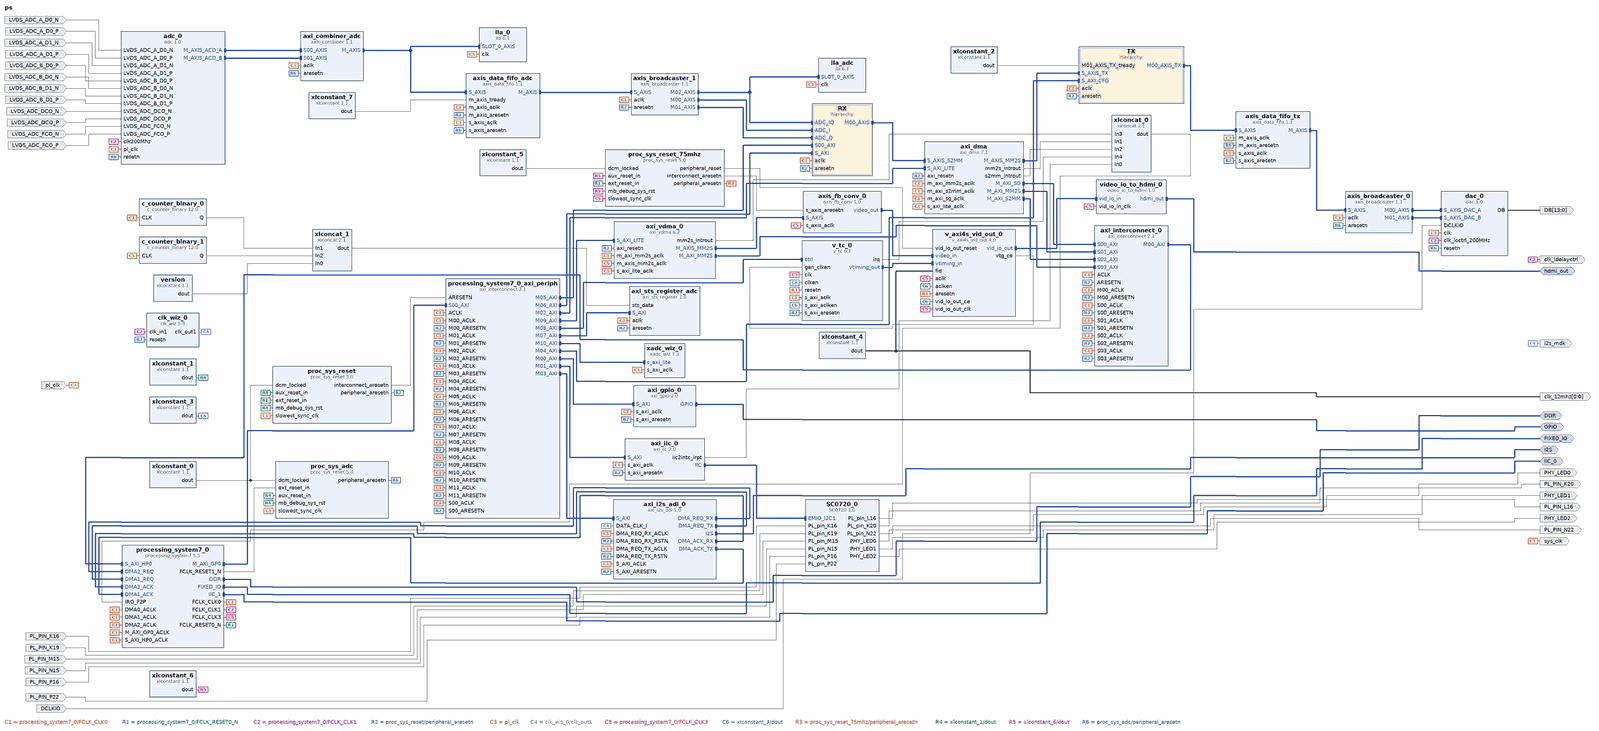
[diagram p0: block diagram of the top level, whole]
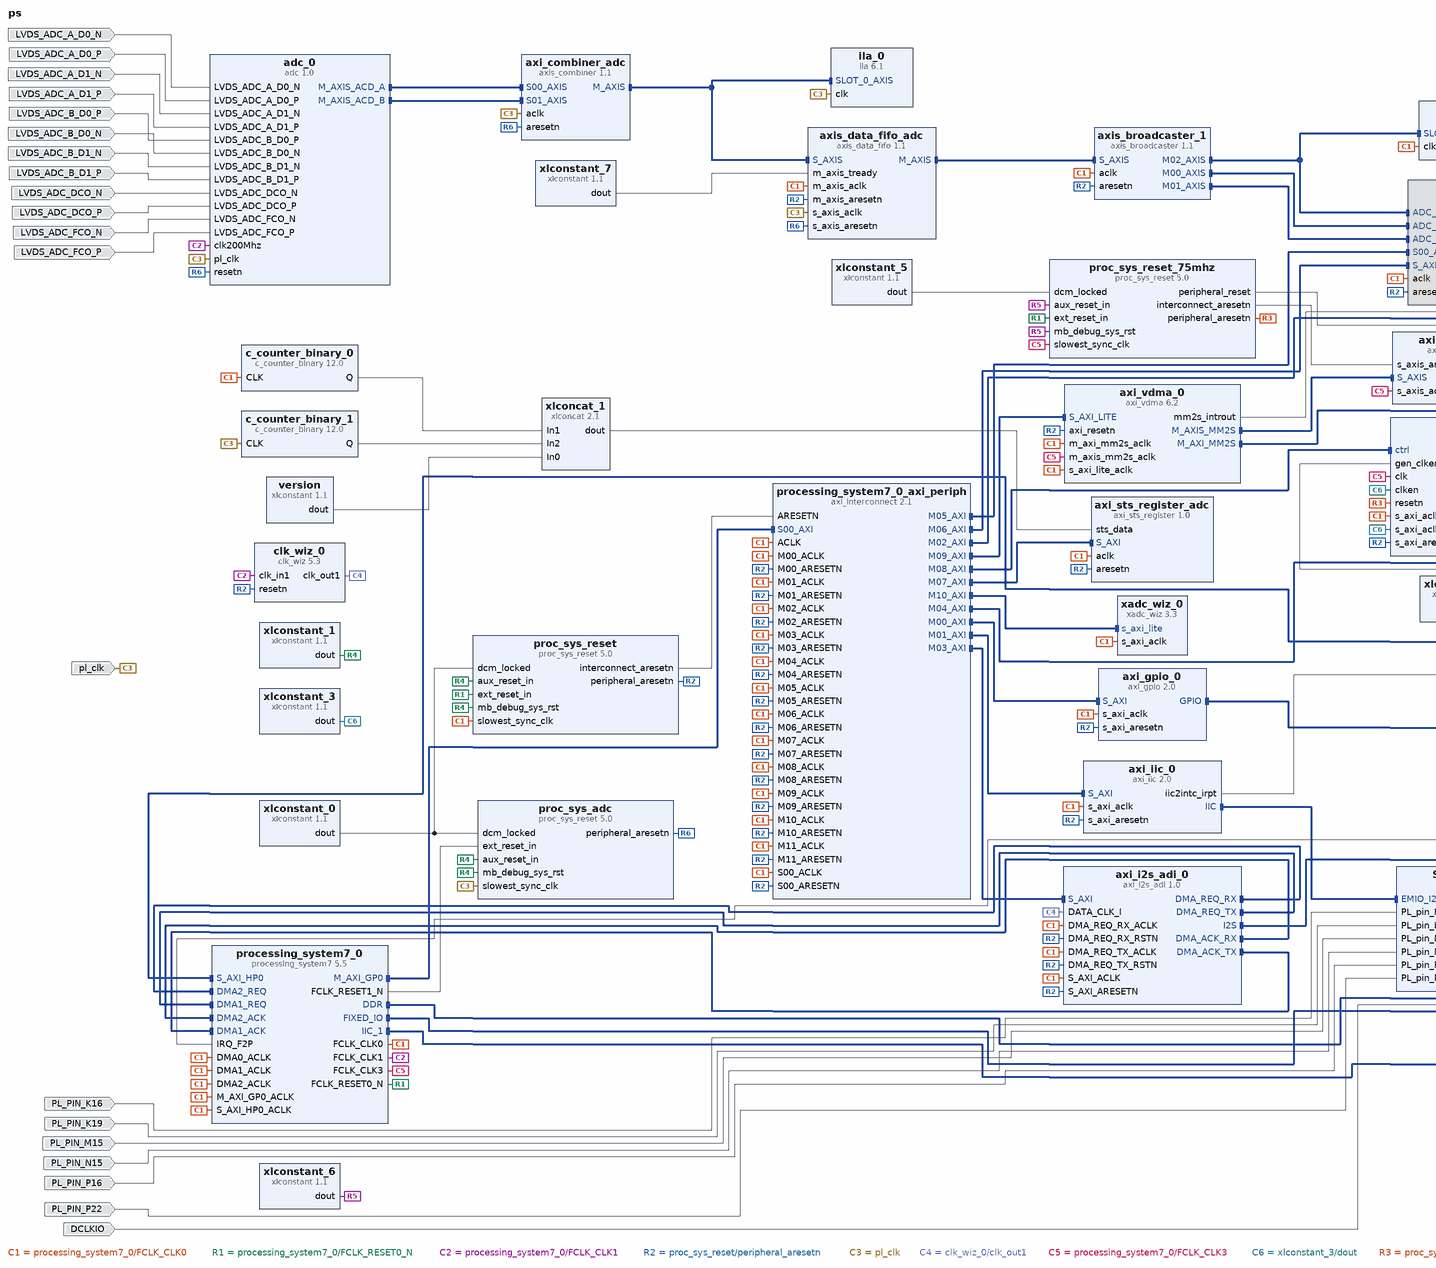
[diagram p1: block diagram of the top level, left part]
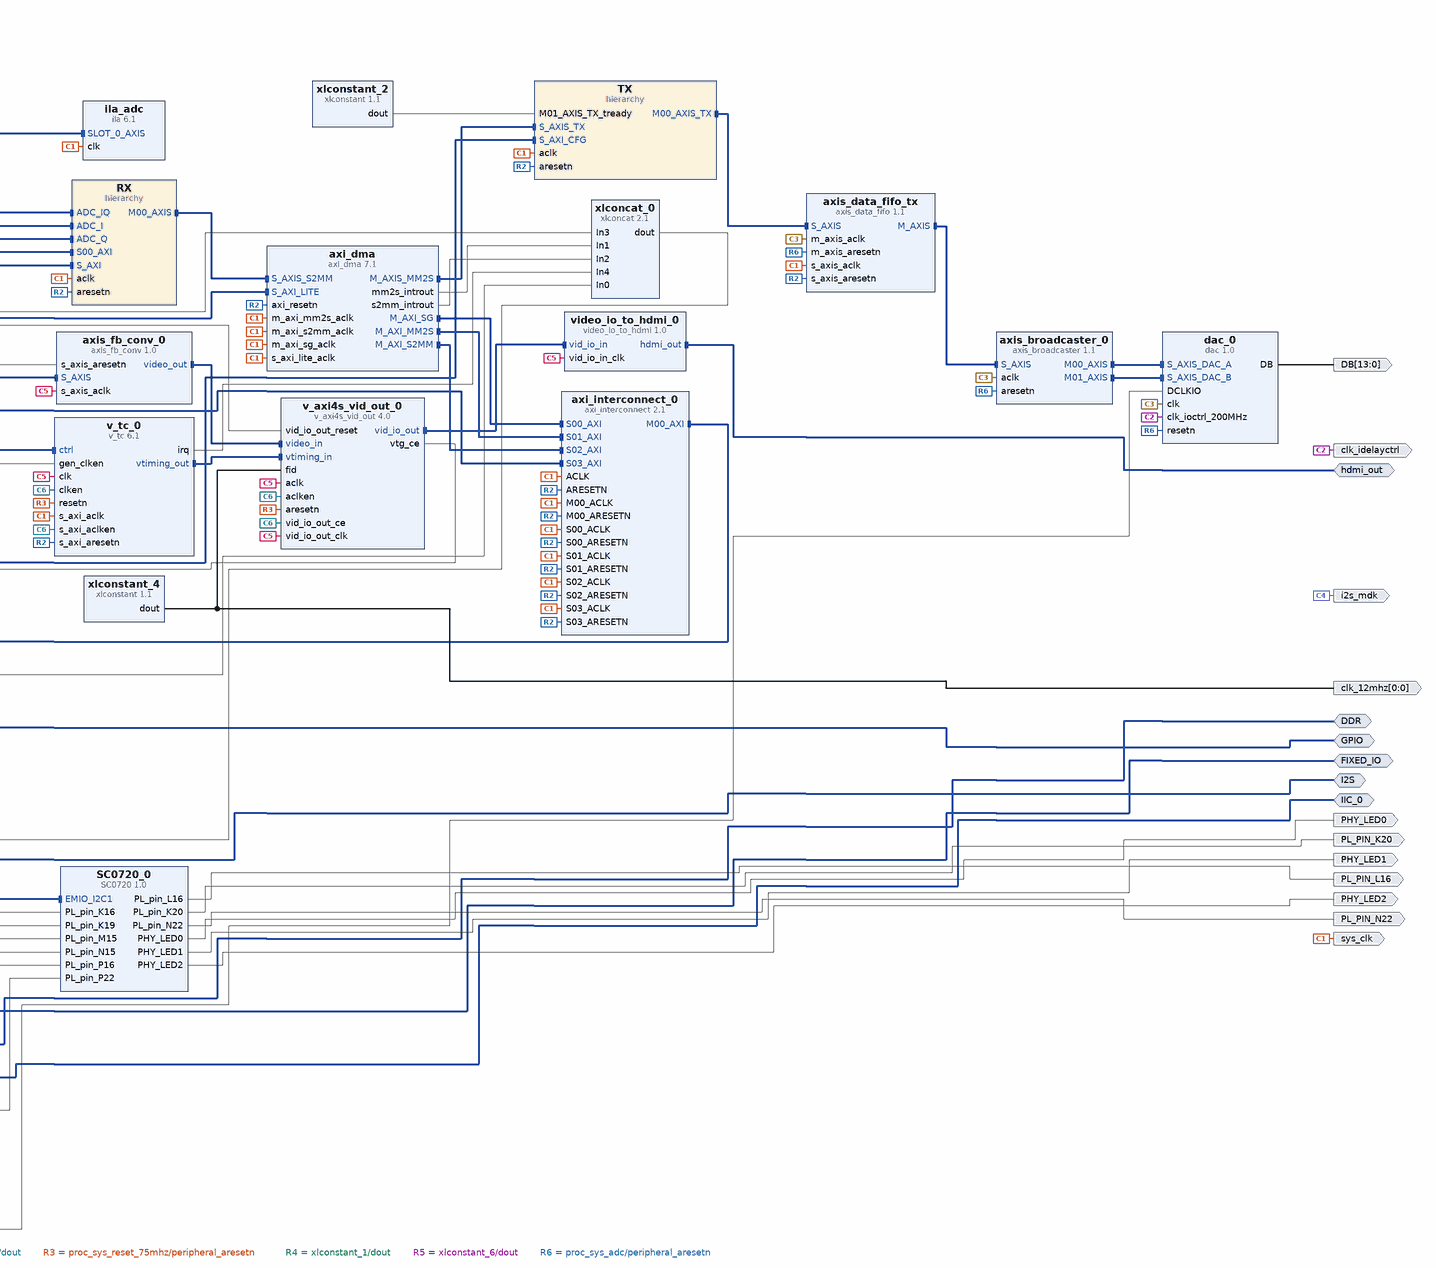
[diagram p2: block diagram of the top level, right part]
# Vivado block design ps, Vivado 2016.2
create_bd_design ps

create_bd_intf_port -mode Master -vlnv xilinx.com:interface:ddrx_rtl:1.0 DDR
create_bd_intf_port -mode Master -vlnv xilinx.com:display_processing_system7:fixedio_rtl:1.0 FIXED_IO
create_bd_intf_port -mode Master -vlnv xilinx.com:interface:iic_rtl:1.0 IIC_0
create_bd_intf_port -mode Master -vlnv xilinx.com:interface:gpio_rtl:1.0 GPIO
create_bd_intf_port -mode Master -vlnv analog.com:interface:i2s_rtl:1.0 I2S
create_bd_intf_port -mode Master -vlnv xilinx.com:interface:hdmi_rtl:1.0 hdmi_out
create_bd_port -dir O -type clk sys_clk
create_bd_port -dir I PL_PIN_K16
create_bd_port -dir I PL_PIN_K19
create_bd_port -dir I PL_PIN_M15
create_bd_port -dir I PL_PIN_N15
create_bd_port -dir I PL_PIN_P16
create_bd_port -dir I PL_PIN_P22
create_bd_port -dir O PL_PIN_L16
create_bd_port -dir O PL_PIN_K20
create_bd_port -dir O PL_PIN_N22
create_bd_port -dir O PHY_LED0
create_bd_port -dir O PHY_LED1
create_bd_port -dir O PHY_LED2
create_bd_port -dir O -type clk clk_idelayctrl
create_bd_port -dir I -type clk pl_clk
set_property -dict {CONFIG.FREQ_HZ 125000000 CONFIG.CLK_DOMAIN ps_processing_system7_0_0_FCLK_CLK0} [get_bd_ports pl_clk]
create_bd_port -dir I LVDS_ADC_A_D0_N
create_bd_port -dir I LVDS_ADC_A_D0_P
create_bd_port -dir I LVDS_ADC_A_D1_N
create_bd_port -dir I LVDS_ADC_A_D1_P
create_bd_port -dir I LVDS_ADC_B_D0_P
create_bd_port -dir I LVDS_ADC_B_D0_N
create_bd_port -dir I LVDS_ADC_B_D1_N
create_bd_port -dir I LVDS_ADC_B_D1_P
create_bd_port -dir I LVDS_ADC_DCO_N
create_bd_port -dir I LVDS_ADC_DCO_P
create_bd_port -dir I LVDS_ADC_FCO_N
create_bd_port -dir I LVDS_ADC_FCO_P
create_bd_port -dir I DCLKIO
create_bd_port -dir O -from 13 -to 0 DB
create_bd_port -dir O -type clk i2s_mdk
create_bd_port -dir O -from 0 -to 0 -type clk clk_12mhz

create_bd_cell -type hier TX
create_bd_cell -type ip -vlnv pavel-demin:user:axi_sts_register:1.0 axi_sts_register_adc
set_property -dict {CONFIG.STS_DATA_WIDTH 256} [get_bd_cells axi_sts_register_adc]
create_bd_cell -type ip -vlnv dl2stg:r2t2:dac:1.0 dac_0
create_bd_cell -type hier RX
create_bd_cell -type ip -vlnv analog.com:user:axi_i2s_adi:1.0 axi_i2s_adi_0
set_property -dict {CONFIG.C_S_AXI_ADDR_WIDTH 16 CONFIG.C_DMA_TYPE 1} [get_bd_cells axi_i2s_adi_0]
create_bd_cell -type ip -vlnv trenz.biz:user:SC0720:1.0 SC0720_0
create_bd_cell -type ip -vlnv trenz.biz:user:video_io_to_hdmi:1.0 video_io_to_hdmi_0
create_bd_cell -type ip -vlnv trenz.biz:user:axis_fb_conv:1.0 axis_fb_conv_0
create_bd_cell -type ip -vlnv dl2stg:r2t2:adc:1.0 adc_0
create_bd_cell -type ip -vlnv xilinx.com:ip:axis_combiner:1.1 axi_combiner_adc
set_property -dict {CONFIG.TDATA_NUM_BYTES 2} [get_bd_cells axi_combiner_adc]
create_bd_cell -type ip -vlnv xilinx.com:ip:axi_dma:7.1 axi_dma
set_property -dict [list \
  CONFIG.c_include_sg 1 \
  CONFIG.c_enable_multi_channel 0 \
  CONFIG.c_sg_include_stscntrl_strm 0 \
  CONFIG.c_micro_dma 0 \
  CONFIG.c_mm2s_burst_size 64 \
  CONFIG.c_include_s2mm 1 \
  CONFIG.c_s2mm_burst_size 64 \
] [get_bd_cells axi_dma]
create_bd_cell -type ip -vlnv xilinx.com:ip:axi_gpio:2.0 axi_gpio_0
set_property -dict [list \
  CONFIG.C_GPIO_WIDTH 12 \
  CONFIG.C_IS_DUAL 0 \
  CONFIG.C_INTERRUPT_PRESENT 0 \
  CONFIG.USE_BOARD_FLOW true \
  CONFIG.GPIO_BOARD_INTERFACE Custom \
] [get_bd_cells axi_gpio_0]
create_bd_cell -type ip -vlnv xilinx.com:ip:axi_iic:2.0 axi_iic_0
create_bd_cell -type ip -vlnv xilinx.com:ip:axi_interconnect:2.1 axi_interconnect_0
set_property -dict {CONFIG.NUM_SI 4 CONFIG.NUM_MI 1 CONFIG.ENABLE_ADVANCED_OPTIONS 0} [get_bd_cells axi_interconnect_0]
create_bd_cell -type ip -vlnv xilinx.com:ip:axi_vdma:6.2 axi_vdma_0
set_property -dict [list \
  CONFIG.c_m_axi_mm2s_data_width 32 \
  CONFIG.c_m_axis_mm2s_tdata_width 32 \
  CONFIG.c_num_fstores 1 \
  CONFIG.c_use_mm2s_fsync 0 \
  CONFIG.c_mm2s_genlock_mode 0 \
  CONFIG.c_mm2s_linebuffer_depth 2048 \
  CONFIG.c_mm2s_max_burst_length 16 \
  CONFIG.c_include_s2mm 0 \
] [get_bd_cells axi_vdma_0]
create_bd_cell -type ip -vlnv xilinx.com:ip:axis_broadcaster:1.1 axis_broadcaster_0
create_bd_cell -type ip -vlnv xilinx.com:ip:axis_broadcaster:1.1 axis_broadcaster_1
set_property -dict [list \
  CONFIG.NUM_MI 3 \
  CONFIG.M_TDATA_NUM_BYTES 4 \
  CONFIG.S_TDATA_NUM_BYTES 4 \
  CONFIG.HAS_TREADY 0 \
  CONFIG.M00_TDATA_REMAP {tdata[15:0],tdata[15:0]} \
  CONFIG.M01_TDATA_REMAP {tdata[31:16],tdata[31:16]} \
  CONFIG.M02_TDATA_REMAP {tdata[31:0]} \
] [get_bd_cells axis_broadcaster_1]
create_bd_cell -type ip -vlnv xilinx.com:ip:axis_data_fifo:1.1 axis_data_fifo_adc
set_property -dict {CONFIG.TDATA_NUM_BYTES 4 CONFIG.FIFO_DEPTH 16 CONFIG.IS_ACLK_ASYNC 1} [get_bd_cells axis_data_fifo_adc]
create_bd_cell -type ip -vlnv xilinx.com:ip:axis_data_fifo:1.1 axis_data_fifo_tx
set_property -dict {CONFIG.TDATA_NUM_BYTES 2 CONFIG.FIFO_DEPTH 16 CONFIG.IS_ACLK_ASYNC 1} [get_bd_cells axis_data_fifo_tx]
create_bd_cell -type ip -vlnv xilinx.com:ip:c_counter_binary:12.0 c_counter_binary_0
set_property -dict {CONFIG.Output_Width 64} [get_bd_cells c_counter_binary_0]
create_bd_cell -type ip -vlnv xilinx.com:ip:c_counter_binary:12.0 c_counter_binary_1
set_property -dict {CONFIG.Output_Width 64} [get_bd_cells c_counter_binary_1]
create_bd_cell -type ip -vlnv xilinx.com:ip:clk_wiz:5.3 clk_wiz_0
set_property -dict [list \
  CONFIG.PRIM_IN_FREQ 200 \
  CONFIG.CLKIN1_JITTER_PS 50.0 \
  CONFIG.CLKOUT2_USED false \
  CONFIG.NUM_OUT_CLKS 1 \
  CONFIG.CLKOUT1_REQUESTED_OUT_FREQ 12.288 \
  CONFIG.CLKOUT2_REQUESTED_OUT_FREQ 100.000 \
  CONFIG.USE_LOCKED false \
  CONFIG.RESET_PORT resetn \
  CONFIG.MMCM_DIVCLK_DIVIDE 9 \
  CONFIG.MMCM_CLKFBOUT_MULT_F 44.375 \
  CONFIG.MMCM_CLKIN1_PERIOD 5.0 \
  CONFIG.MMCM_CLKOUT0_DIVIDE_F 80.250 \
  CONFIG.MMCM_CLKOUT1_DIVIDE 1 \
  CONFIG.RESET_TYPE ACTIVE_LOW \
  CONFIG.CLKOUT1_JITTER 327.996 \
  CONFIG.CLKOUT1_PHASE_ERROR 264.435 \
  CONFIG.CLKOUT2_JITTER 269.718 \
  CONFIG.CLKOUT2_PHASE_ERROR 196.976 \
] [get_bd_cells clk_wiz_0]
create_bd_cell -type ip -vlnv xilinx.com:ip:ila:6.1 ila_adc
set_property -dict {CONFIG.C_NUM_OF_PROBES 9 CONFIG.C_SLOT_0_AXI_PROTOCOL AXI4S} [get_bd_cells ila_adc]
create_bd_cell -type ip -vlnv xilinx.com:ip:proc_sys_reset:5.0 proc_sys_adc
set_property -dict {CONFIG.C_AUX_RESET_HIGH 1} [get_bd_cells proc_sys_adc]
create_bd_cell -type ip -vlnv xilinx.com:ip:proc_sys_reset:5.0 proc_sys_reset
set_property -dict {CONFIG.C_AUX_RESET_HIGH 1} [get_bd_cells proc_sys_reset]
create_bd_cell -type ip -vlnv xilinx.com:ip:proc_sys_reset:5.0 proc_sys_reset_75mhz
set_property -dict {CONFIG.C_AUX_RESET_HIGH 1} [get_bd_cells proc_sys_reset_75mhz]
create_bd_cell -type ip -vlnv xilinx.com:ip:processing_system7:5.5 processing_system7_0
set_property -dict [list \
  CONFIG.PCW_FCLK_CLK0_BUF true \
  CONFIG.PCW_UIPARAM_DDR_FREQ_MHZ 533.333333 \
  CONFIG.PCW_APU_PERIPHERAL_FREQMHZ 666.666666 \
  CONFIG.PCW_SDIO_PERIPHERAL_FREQMHZ 100 \
  CONFIG.PCW_UART_PERIPHERAL_FREQMHZ 100 \
  CONFIG.PCW_I2C_PERIPHERAL_FREQMHZ 111.111115 \
  CONFIG.PCW_FPGA0_PERIPHERAL_FREQMHZ 125 \
  CONFIG.PCW_FPGA1_PERIPHERAL_FREQMHZ 200 \
  CONFIG.PCW_FPGA2_PERIPHERAL_FREQMHZ 1 \
  CONFIG.PCW_FPGA3_PERIPHERAL_FREQMHZ 75 \
  CONFIG.PCW_USE_S_AXI_HP0 1 \
  CONFIG.PCW_M_AXI_GP0_FREQMHZ 10 \
  CONFIG.PCW_USE_DMA0 1 \
  CONFIG.PCW_USE_DMA1 1 \
  CONFIG.PCW_USE_DMA2 1 \
  CONFIG.PCW_USE_FABRIC_INTERRUPT 1 \
  CONFIG.PCW_EN_CLK1_PORT 1 \
  CONFIG.PCW_EN_CLK2_PORT 1 \
  CONFIG.PCW_EN_CLK3_PORT 1 \
  CONFIG.PCW_EN_RST1_PORT 1 \
  CONFIG.PCW_EN_RST2_PORT 1 \
  CONFIG.PCW_IRQ_F2P_INTR 1 \
  CONFIG.PCW_PERIPHERAL_BOARD_PRESET part0 \
  CONFIG.PCW_PRESET_BANK1_VOLTAGE {LVCMOS 1.8V} \
  CONFIG.PCW_UIPARAM_DDR_PARTNO {MT41J256M16 RE-125} \
  CONFIG.PCW_QSPI_PERIPHERAL_ENABLE 1 \
  CONFIG.PCW_QSPI_QSPI_IO {MIO 1 .. 6} \
  CONFIG.PCW_QSPI_GRP_SINGLE_SS_ENABLE 1 \
  CONFIG.PCW_QSPI_GRP_SINGLE_SS_IO {MIO 1 .. 6} \
  CONFIG.PCW_QSPI_GRP_FBCLK_ENABLE 1 \
  CONFIG.PCW_QSPI_GRP_FBCLK_IO {MIO 8} \
  CONFIG.PCW_ENET0_PERIPHERAL_ENABLE 1 \
  CONFIG.PCW_ENET0_ENET0_IO {MIO 16 .. 27} \
  CONFIG.PCW_ENET0_GRP_MDIO_ENABLE 1 \
  CONFIG.PCW_ENET0_GRP_MDIO_IO {MIO 52 .. 53} \
  CONFIG.PCW_ENET_RESET_ENABLE 0 \
  CONFIG.PCW_SD0_PERIPHERAL_ENABLE 1 \
  CONFIG.PCW_SD0_SD0_IO {MIO 40 .. 45} \
  CONFIG.PCW_SD0_GRP_CD_ENABLE 1 \
  CONFIG.PCW_SD0_GRP_CD_IO EMIO \
  CONFIG.PCW_SD0_GRP_WP_ENABLE 1 \
  CONFIG.PCW_SD0_GRP_WP_IO EMIO \
  CONFIG.PCW_SD1_PERIPHERAL_ENABLE 1 \
  CONFIG.PCW_SD1_SD1_IO {MIO 46 .. 51} \
  CONFIG.PCW_SD1_GRP_CD_ENABLE 1 \
  CONFIG.PCW_SD1_GRP_CD_IO EMIO \
  CONFIG.PCW_SD1_GRP_WP_ENABLE 1 \
  CONFIG.PCW_SD1_GRP_WP_IO EMIO \
  CONFIG.PCW_UART0_PERIPHERAL_ENABLE 1 \
  CONFIG.PCW_UART0_UART0_IO {MIO 14 .. 15} \
  CONFIG.PCW_UART1_PERIPHERAL_ENABLE 1 \
  CONFIG.PCW_UART1_UART1_IO {MIO 12 .. 13} \
  CONFIG.PCW_SPI0_PERIPHERAL_ENABLE 1 \
  CONFIG.PCW_SPI0_SPI0_IO EMIO \
  CONFIG.PCW_SPI1_PERIPHERAL_ENABLE 1 \
  CONFIG.PCW_SPI1_SPI1_IO EMIO \
  CONFIG.PCW_TTC0_PERIPHERAL_ENABLE 1 \
  CONFIG.PCW_TTC0_TTC0_IO EMIO \
  CONFIG.PCW_TTC1_PERIPHERAL_ENABLE 1 \
  CONFIG.PCW_TTC1_TTC1_IO EMIO \
  CONFIG.PCW_USB0_PERIPHERAL_ENABLE 1 \
  CONFIG.PCW_USB0_USB0_IO {MIO 28 .. 39} \
  CONFIG.PCW_USB_RESET_ENABLE 0 \
  CONFIG.PCW_I2C0_PERIPHERAL_ENABLE 1 \
  CONFIG.PCW_I2C0_I2C0_IO EMIO \
  CONFIG.PCW_I2C1_PERIPHERAL_ENABLE 1 \
  CONFIG.PCW_I2C1_I2C1_IO EMIO \
  CONFIG.PCW_I2C_RESET_ENABLE 0 \
  CONFIG.PCW_GPIO_MIO_GPIO_ENABLE 1 \
  CONFIG.PCW_GPIO_MIO_GPIO_IO MIO \
  CONFIG.PCW_FCLK3_PERIPHERAL_CLKSRC {ARM PLL} \
  CONFIG.preset Default \
  CONFIG.PCW_UIPARAM_GENERATE_SUMMARY NONE \
] [get_bd_cells processing_system7_0]
# 501 more settings of processing_system7_0 are not shown: defaults, MIO pin electricals, DDR timing, and values the tool derives
create_bd_cell -type ip -vlnv xilinx.com:ip:axi_interconnect:2.1 processing_system7_0_axi_periph
set_property -dict {CONFIG.NUM_MI 12 CONFIG.STRATEGY 1} [get_bd_cells processing_system7_0_axi_periph]
create_bd_cell -type ip -vlnv xilinx.com:ip:v_axi4s_vid_out:4.0 v_axi4s_vid_out_0
set_property -dict {CONFIG.C_S_AXIS_VIDEO_FORMAT 2 CONFIG.C_S_AXIS_VIDEO_DATA_WIDTH 8} [get_bd_cells v_axi4s_vid_out_0]
create_bd_cell -type ip -vlnv xilinx.com:ip:v_tc:6.1 v_tc_0
set_property -dict {CONFIG.enable_detection false} [get_bd_cells v_tc_0]
create_bd_cell -type ip -vlnv xilinx.com:ip:xlconstant:1.1 version
set_property -dict {CONFIG.CONST_WIDTH 128 CONFIG.CONST_VAL 2} [get_bd_cells version]
create_bd_cell -type ip -vlnv xilinx.com:ip:xadc_wiz:3.3 xadc_wiz_0
set_property -dict [list \
  CONFIG.XADC_STARUP_SELECTION channel_sequencer \
  CONFIG.DCLK_FREQUENCY 125 \
  CONFIG.ADC_CONVERSION_RATE 1000 \
  CONFIG.SEQUENCER_MODE Continuous \
  CONFIG.SINGLE_CHANNEL_SELECTION TEMPERATURE \
  CONFIG.EXTERNAL_MUX_CHANNEL VP_VN \
  CONFIG.CHANNEL_ENABLE_VP_VN true \
] [get_bd_cells xadc_wiz_0]
create_bd_cell -type ip -vlnv xilinx.com:ip:xlconcat:2.1 xlconcat_0
set_property -dict {CONFIG.NUM_PORTS 5} [get_bd_cells xlconcat_0]
create_bd_cell -type ip -vlnv xilinx.com:ip:xlconcat:2.1 xlconcat_1
set_property -dict {CONFIG.NUM_PORTS 3 CONFIG.IN0_WIDTH 128 CONFIG.IN1_WIDTH 64 CONFIG.IN2_WIDTH 64} [get_bd_cells xlconcat_1]
create_bd_cell -type ip -vlnv xilinx.com:ip:xlconstant:1.1 xlconstant_0
create_bd_cell -type ip -vlnv xilinx.com:ip:xlconstant:1.1 xlconstant_1
set_property -dict {CONFIG.CONST_VAL 0} [get_bd_cells xlconstant_1]
create_bd_cell -type ip -vlnv xilinx.com:ip:xlconstant:1.1 xlconstant_2
create_bd_cell -type ip -vlnv xilinx.com:ip:xlconstant:1.1 xlconstant_3
create_bd_cell -type ip -vlnv xilinx.com:ip:xlconstant:1.1 xlconstant_4
set_property -dict {CONFIG.CONST_VAL 0} [get_bd_cells xlconstant_4]
create_bd_cell -type ip -vlnv xilinx.com:ip:xlconstant:1.1 xlconstant_5
create_bd_cell -type ip -vlnv xilinx.com:ip:xlconstant:1.1 xlconstant_6
set_property -dict {CONFIG.CONST_VAL 0} [get_bd_cells xlconstant_6]
create_bd_cell -type ip -vlnv xilinx.com:ip:xlconstant:1.1 xlconstant_7
create_bd_cell -type ip -vlnv xilinx.com:ip:ila:6.1 ila_0
set_property -dict {CONFIG.C_NUM_OF_PROBES 9 CONFIG.C_SLOT_0_AXI_PROTOCOL AXI4S} [get_bd_cells ila_0]

# ---- hierarchy /TX ----
current_bd_instance /TX
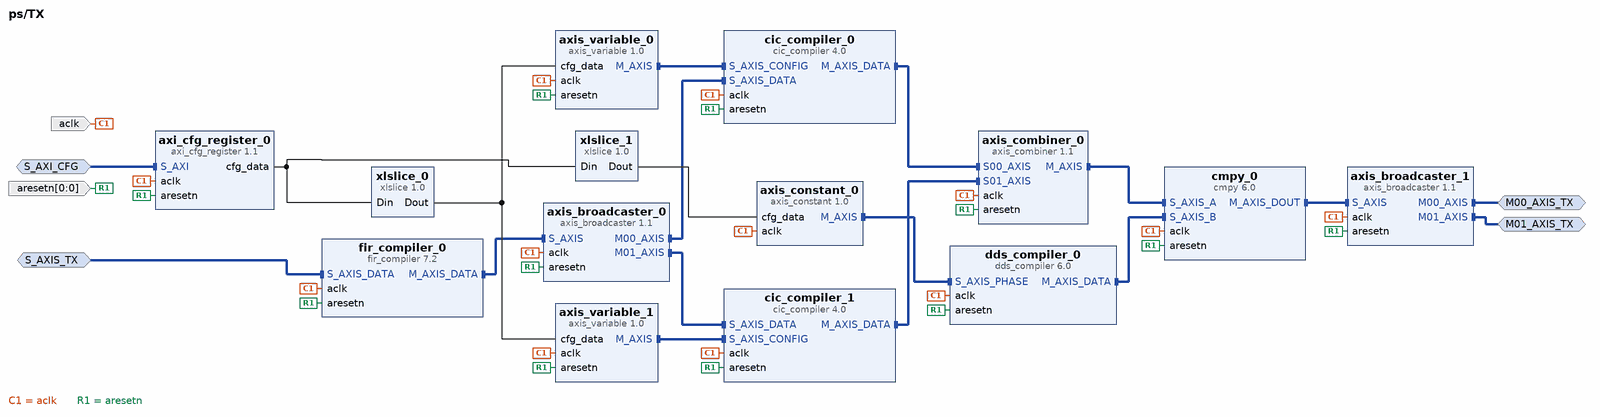
[diagram p3: block diagram inside /TX]
create_bd_intf_pin -mode Slave -vlnv xilinx.com:interface:aximm_rtl:1.0 S_AXI_CFG
create_bd_intf_pin -mode Slave -vlnv xilinx.com:interface:axis_rtl:1.0 S_AXIS_TX
create_bd_intf_pin -mode Master -vlnv xilinx.com:interface:axis_rtl:1.0 M00_AXIS_TX
create_bd_intf_pin -mode Master -vlnv xilinx.com:interface:axis_rtl:1.0 M01_AXIS_TX
create_bd_pin -dir I aclk
create_bd_pin -dir I -from 0 -to 0 aresetn

create_bd_cell -type ip -vlnv pavel-demin:user:axis_variable:1.0 axis_variable_0
set_property -dict {CONFIG.AXIS_TDATA_WIDTH 16} [get_bd_cells axis_variable_0]
create_bd_cell -type ip -vlnv pavel-demin:user:axis_variable:1.0 axis_variable_1
set_property -dict {CONFIG.AXIS_TDATA_WIDTH 16} [get_bd_cells axis_variable_1]
create_bd_cell -type ip -vlnv pavel-demin:user:axis_constant:1.0 axis_constant_0
create_bd_cell -type ip -vlnv pavel-demin:user:axi_cfg_register:1.1 axi_cfg_register_0
set_property -dict {CONFIG.CFG_DATA_WIDTH 64 CONFIG.CFG_DATA_DEFAULT {64'h051eb8510000007d'}} [get_bd_cells axi_cfg_register_0]
create_bd_cell -type ip -vlnv xilinx.com:ip:axis_broadcaster:1.1 axis_broadcaster_0
set_property -dict [list \
  CONFIG.M_TDATA_NUM_BYTES 3 \
  CONFIG.S_TDATA_NUM_BYTES 8 \
  CONFIG.HAS_TREADY 1 \
  CONFIG.M00_TDATA_REMAP {tdata[23:0]} \
  CONFIG.M01_TDATA_REMAP {tdata[55:32]} \
] [get_bd_cells axis_broadcaster_0]
create_bd_cell -type ip -vlnv xilinx.com:ip:axis_broadcaster:1.1 axis_broadcaster_1
set_property -dict [list \
  CONFIG.M_TDATA_NUM_BYTES 2 \
  CONFIG.S_TDATA_NUM_BYTES 6 \
  CONFIG.M00_TDATA_REMAP {tdata[15:0]} \
  CONFIG.M01_TDATA_REMAP {tdata[39:24]} \
] [get_bd_cells axis_broadcaster_1]
create_bd_cell -type ip -vlnv xilinx.com:ip:axis_combiner:1.1 axis_combiner_0
set_property -dict {CONFIG.TDATA_NUM_BYTES 3 CONFIG.HAS_TLAST 1} [get_bd_cells axis_combiner_0]
create_bd_cell -type ip -vlnv xilinx.com:ip:cic_compiler:4.0 cic_compiler_0
set_property -dict [list \
  CONFIG.Number_Of_Stages 5 \
  CONFIG.Sample_Rate_Changes Programmable \
  CONFIG.Fixed_Or_Initial_Rate 625 \
  CONFIG.Minimum_Rate 125 \
  CONFIG.Maximum_Rate 3125 \
  CONFIG.Input_Sample_Frequency 1 \
  CONFIG.Clock_Frequency 125 \
  CONFIG.SamplePeriod 125 \
  CONFIG.Input_Data_Width 24 \
  CONFIG.Quantization Truncation \
  CONFIG.Output_Data_Width 24 \
  CONFIG.Use_Xtreme_DSP_Slice false \
  CONFIG.HAS_ARESETN true \
  CONFIG.HAS_DOUT_TREADY true \
] [get_bd_cells cic_compiler_0]
create_bd_cell -type ip -vlnv xilinx.com:ip:cic_compiler:4.0 cic_compiler_1
set_property -dict [list \
  CONFIG.Number_Of_Stages 5 \
  CONFIG.Sample_Rate_Changes Programmable \
  CONFIG.Fixed_Or_Initial_Rate 625 \
  CONFIG.Minimum_Rate 125 \
  CONFIG.Maximum_Rate 3125 \
  CONFIG.Input_Sample_Frequency 1 \
  CONFIG.Clock_Frequency 125 \
  CONFIG.SamplePeriod 125 \
  CONFIG.Input_Data_Width 24 \
  CONFIG.Quantization Truncation \
  CONFIG.Output_Data_Width 24 \
  CONFIG.Use_Xtreme_DSP_Slice false \
  CONFIG.HAS_ARESETN true \
  CONFIG.HAS_DOUT_TREADY true \
] [get_bd_cells cic_compiler_1]
create_bd_cell -type ip -vlnv xilinx.com:ip:cmpy:6.0 cmpy_0
set_property -dict [list \
  CONFIG.APortWidth 24 \
  CONFIG.BPortWidth 24 \
  CONFIG.FlowControl Blocking \
  CONFIG.RoundMode Truncate \
  CONFIG.OutputWidth 18 \
  CONFIG.MinimumLatency 12 \
  CONFIG.ARESETN true \
] [get_bd_cells cmpy_0]
create_bd_cell -type ip -vlnv xilinx.com:ip:dds_compiler:6.0 dds_compiler_0
set_property -dict [list \
  CONFIG.DDS_Clock_Rate 125 \
  CONFIG.Parameter_Entry System_Parameters \
  CONFIG.Spurious_Free_Dynamic_Range 138 \
  CONFIG.Frequency_Resolution 0.2 \
  CONFIG.Noise_Shaping Auto \
  CONFIG.Phase_Width 30 \
  CONFIG.Output_Width 24 \
  CONFIG.Phase_Increment Streaming \
  CONFIG.Negative_Sine true \
  CONFIG.Has_Phase_Out false \
  CONFIG.DATA_Has_TLAST Not_Required \
  CONFIG.Has_TREADY true \
  CONFIG.S_PHASE_Has_TUSER Not_Required \
  CONFIG.M_DATA_Has_TUSER Not_Required \
  CONFIG.Latency 16 \
  CONFIG.Has_ARESETn true \
  CONFIG.Output_Frequency1 0 \
  CONFIG.PINC1 0 \
] [get_bd_cells dds_compiler_0]
create_bd_cell -type ip -vlnv xilinx.com:ip:fir_compiler:7.2 fir_compiler_0
set_property -dict [list \
  CONFIG.CoefficientVector {-1.64776395523261e-08, -4.73223982493382e-08, -7.93114097748734e-10, 3.09341607494277e-08, 1.86268604565617e-08, 3.27485571200346e-08, -6.29908653657968e-09, -1.52279861575043e-07, -8.30460847858456e-08, 3.14535491822606e-07, 3.05626738325402e-07, -4.74172694219994e-07, -7.13495049416347e-07, 5.47323968241002e-07, 1.33462183148789e-06, -4.14140755019506e-07, -2.15051006195781e-06, -6.77410015715413e-08, 3.07546485446303e-06, 1.03702255417565e-06, -3.94436393706816e-06, -2.59191311589838e-06, 4.51537519422448e-06, 4.74782575774399e-06, -4.49284245797096e-06, -7.39824596121288e-06, 3.57216304293944e-06, 1.0289531398643e-05, -1.50382000963687e-06, -1.30208669437029e-05, -1.8320780740752e-06, 1.50781578706169e-05, 6.35464869916574e-06, -1.5905693254477e-05, -1.17324822432291e-05, 1.50110146034995e-05, 1.73719815499574e-05, -1.20943524633858e-05, -2.24668827259553e-05, 7.16974344173206e-06, 2.61032685003911e-05, -6.63576078703743e-07, -2.74292794572945e-05, -6.55062322922545e-06, 2.5864354889803e-05, 1.32043152416442e-05, -2.13170377303369e-05, -1.7790015052466e-05, 1.4366401658372e-05, 1.88196488042346e-05, -6.35769575620025e-06, -1.51624671610732e-05, -6.3454751890034e-07, 6.41574547942767e-06, 4.00779001049893e-06, 6.75760336386084e-06, -1.00538045567379e-06, -2.24030234065108e-05, -1.07626302618669e-05, 3.72333834565482e-05, 3.27008161208513e-05, -4.68605170112616e-05, -6.46526581514427e-05, 4.62599879903061e-05, 0.000104401861517261, -3.05403948192664e-05, -0.00014745720335074, -4.12013707266912e-06, 0.000187185910308468, 5.9472285269084e-05, -0.000215374917579779, -0.000134302073078784, 0.000223224152976694, 0.00022383529853513, -0.000202700646279518, -0.000319623716269056, 0.000148096208070561, 0.00041005036860653, -5.75597854424301e-05, -0.000481514995957391, -6.56763133492148e-05, 0.000520250999114949, 0.000212664164338231, -0.000514618719419215, -0.000369005842837135, 0.000457467389871147, 0.000515973656086604, -0.000348477939755869, -0.000632881279945779, 0.000195649794954827, 0.000700188749146281, -1.57992717633881e-05, -0.000703205392036612, -0.000166376697710665, 0.000635843920605569, 0.00032083226194399, -0.000503811084211153, -0.000416255319934634, 0.000326569991673316, 0.000425391875921946, -0.00013746695448704, -0.000331045335837557, -1.84322419198225e-05, 0.000131952870425038, 8.8991373620273e-05, 0.000152406451111629, -2.20059552576483e-05, -0.000479109327658611, -0.000226158943701414, 0.000781596108897923, 0.000680336287236396, -0.000973841573779158, -0.00133743086810108, 0.000957505429554979, 0.00215823795933061, -0.000633058497914659, -0.00306239583565753, -8.62773868301778e-05, 0.00392749237767837, 0.00125890086582158, -0.0045932013828814, -0.002899064621986, 0.00487080892138405, 0.00496271652177841, -0.00455788126865406, -0.00733667233358662, 0.00345716360480598, 0.00983253607996904, -0.00139819324342049, -0.0121861637129463, -0.00174034328863689, 0.014062282608939, 0.00600853672502155, -0.0150655751552465, -0.01137014160612, 0.0147483575782911, 0.0176872274320504, -0.0126185258485222, -0.0247131655485743, 0.00813090350262748, 0.0320864711007864, -0.000645151353472906, -0.0393170493516836, -0.0106924075067383, 0.0457366439777749, 0.0272501703222767, -0.0503214712404459, -0.0517158392679872, 0.0510195785361982, 0.0905708960358907, -0.0416085827802432, -0.163747940036716, -0.0107991247506511, 0.356391980570419, 0.554821620626239, 0.356391980570419, -0.0107991247506511, -0.163747940036716, -0.0416085827802432, 0.0905708960358907, 0.0510195785361982, -0.0517158392679871, -0.0503214712404459, 0.0272501703222767, 0.0457366439777748, -0.0106924075067384, -0.0393170493516836, -0.000645151353472902, 0.0320864711007864, 0.00813090350262744, -0.0247131655485743, -0.0126185258485222, 0.0176872274320504, 0.014748357578291, -0.01137014160612, -0.0150655751552464, 0.00600853672502154, 0.014062282608939, -0.00174034328863689, -0.0121861637129463, -0.0013981932434205, 0.00983253607996903, 0.00345716360480599, -0.00733667233358662, -0.00455788126865407, 0.00496271652177837, 0.00487080892138405, -0.00289906462198599, -0.0045932013828814, 0.00125890086582158, 0.00392749237767837, -8.62773868301858e-05, -0.00306239583565753, -0.000633058497914665, 0.00215823795933062, 0.000957505429554986, -0.00133743086810109, -0.00097384157377915, 0.000680336287236399, 0.000781596108897926, -0.000226158943701417, -0.000479109327658599, -2.20059552576474e-05, 0.000152406451111619, 8.89913736202697e-05, 0.000131952870425043, -1.84322419198184e-05, -0.000331045335837562, -0.000137466954487046, 0.000425391875921945, 0.000326569991673318, -0.000416255319934626, -0.000503811084211157, 0.000320832261943976, 0.000635843920605571, -0.000166376697710658, -0.000703205392036611, -1.57992717634175e-05, 0.000700188749146282, 0.000195649794954849, -0.00063288127994578, -0.000348477939755879, 0.000515973656086602, 0.000457467389871152, -0.000369005842837133, -0.00051461871941922, 0.00021266416433823, 0.00052025099911495, -6.5676313349214e-05, -0.000481514995957386, -5.75597854424309e-05, 0.00041005036860653, 0.000148096208070561, -0.000319623716269053, -0.000202700646279518, 0.00022383529853513, 0.000223224152976694, -0.000134302073078785, -0.000215374917579779, 5.94722852690836e-05, 0.000187185910308467, -4.1201370726696e-06, -0.000147457203350739, -3.05403948192655e-05, 0.00010440186151726, 4.62599879903048e-05, -6.46526581514424e-05, -4.68605170112612e-05, 3.27008161208512e-05, 3.72333834565472e-05, -1.07626302618669e-05, -2.24030234065122e-05, -1.00538045567376e-06, 6.75760336386114e-06, 4.00779001049914e-06, 6.41574547942654e-06, -6.34547518900236e-07, -1.51624671610739e-05, -6.35769575620011e-06, 1.88196488042347e-05, 1.43664016583718e-05, -1.77900150524658e-05, -2.13170377303367e-05, 1.32043152416438e-05, 2.58643548898028e-05, -6.55062322922483e-06, -2.74292794572945e-05, -6.63576078704085e-07, 2.61032685003909e-05, 7.16974344173231e-06, -2.24668827259554e-05, -1.20943524633859e-05, 1.73719815499574e-05, 1.50110146034996e-05, -1.1732482243229e-05, -1.59056932544774e-05, 6.35464869916573e-06, 1.5078157870617e-05, -1.83207807407521e-06, -1.30208669437035e-05, -1.50382000963686e-06, 1.02895313986436e-05, 3.57216304293944e-06, -7.39824596121333e-06, -4.49284245797099e-06, 4.74782575774417e-06, 4.51537519422448e-06, -2.59191311589829e-06, -3.94436393706815e-06, 1.03702255417562e-06, 3.07546485446302e-06, -6.77410015715271e-08, -2.15051006195779e-06, -4.14140755019505e-07, 1.33462183148789e-06, 5.47323968241007e-07, -7.13495049416342e-07, -4.7417269421995e-07, 3.05626738325399e-07, 3.1453549182257e-07, -8.30460847858442e-08, -1.52279861575044e-07, -6.29908653657931e-09, 3.27485571200189e-08, 1.86268604565597e-08, 3.09341607494308e-08, -7.93114097748315e-10, -4.73223982493358e-08, -1.64776395523266e-08} \
  CONFIG.Coefficient_Sets 1 \
  CONFIG.Filter_Type Interpolation \
  CONFIG.Interpolation_Rate 2 \
  CONFIG.Decimation_Rate 1 \
  CONFIG.Zero_Pack_Factor 1 \
  CONFIG.Number_Channels 1 \
  CONFIG.Number_Paths 2 \
  CONFIG.RateSpecification Frequency_Specification \
  CONFIG.Sample_Frequency 0.5 \
  CONFIG.Clock_Frequency 125 \
  CONFIG.Coefficient_Sign Signed \
  CONFIG.Quantization Quantize_Only \
  CONFIG.Coefficient_Width 24 \
  CONFIG.BestPrecision true \
  CONFIG.Coefficient_Fractional_Bits 23 \
  CONFIG.Coefficient_Structure Inferred \
  CONFIG.Data_Width 16 \
  CONFIG.Output_Rounding_Mode Truncate_LSBs \
  CONFIG.Output_Width 26 \
  CONFIG.Filter_Architecture Systolic_Multiply_Accumulate \
  CONFIG.M_DATA_Has_TREADY true \
  CONFIG.Has_ARESETn true \
] [get_bd_cells fir_compiler_0]
create_bd_cell -type ip -vlnv xilinx.com:ip:xlslice:1.0 xlslice_0
set_property -dict {CONFIG.DOUT_WIDTH 16 CONFIG.DIN_TO 0 CONFIG.DIN_FROM 15 CONFIG.DIN_WIDTH 64} [get_bd_cells xlslice_0]
create_bd_cell -type ip -vlnv xilinx.com:ip:xlslice:1.0 xlslice_1
set_property -dict {CONFIG.DOUT_WIDTH 32 CONFIG.DIN_TO 32 CONFIG.DIN_FROM 63 CONFIG.DIN_WIDTH 64} [get_bd_cells xlslice_1]

# ---- hierarchy /RX ----
current_bd_instance /RX
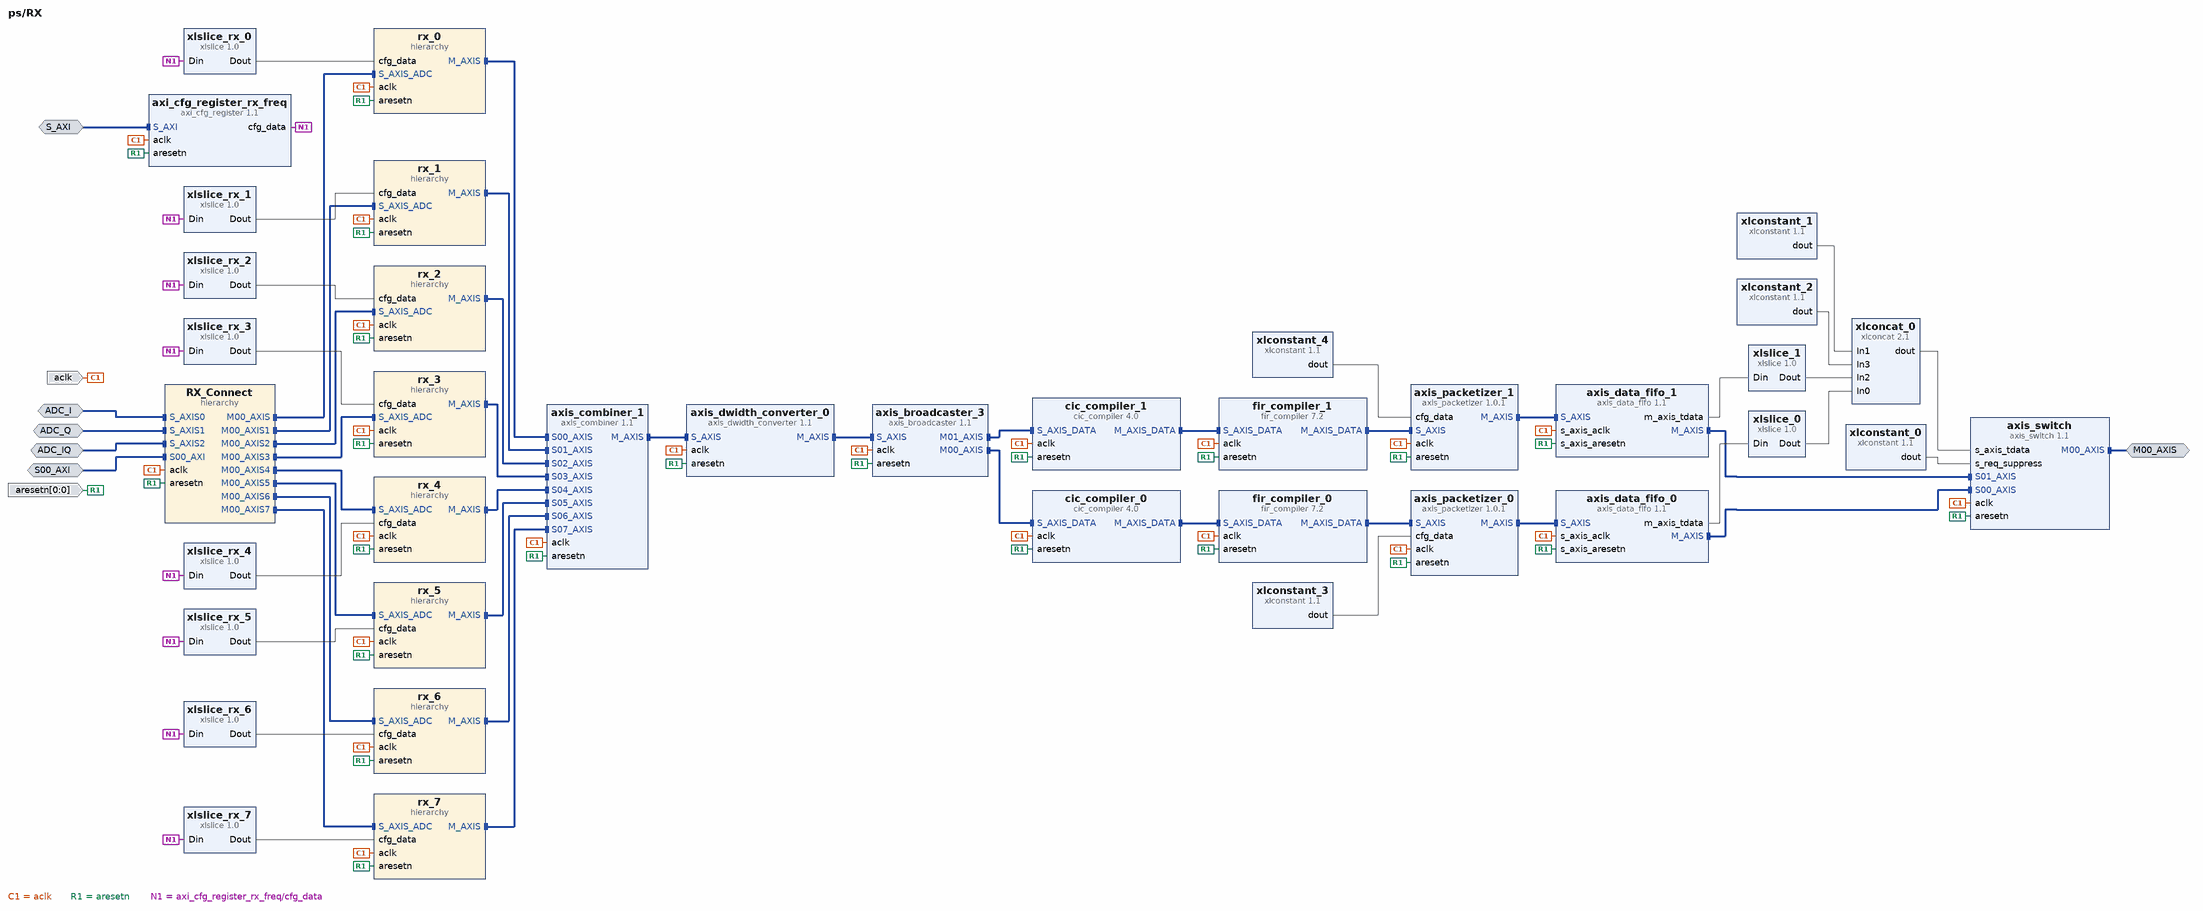
[diagram p4: block diagram inside /RX]
create_bd_intf_pin -mode Master -vlnv xilinx.com:interface:axis_rtl:1.0 M00_AXIS
create_bd_intf_pin -mode Slave -vlnv xilinx.com:interface:axis_rtl:1.0 ADC_I
create_bd_intf_pin -mode Slave -vlnv xilinx.com:interface:axis_rtl:1.0 ADC_Q
create_bd_intf_pin -mode Slave -vlnv xilinx.com:interface:axis_rtl:1.0 ADC_IQ
create_bd_intf_pin -mode Slave -vlnv xilinx.com:interface:aximm_rtl:1.0 S00_AXI
create_bd_intf_pin -mode Slave -vlnv xilinx.com:interface:aximm_rtl:1.0 S_AXI
create_bd_pin -dir I aclk
create_bd_pin -dir I -from 0 -to 0 aresetn

create_bd_cell -type hier rx_1
create_bd_cell -type hier RX_Connect
create_bd_cell -type ip -vlnv pavel-demin:user:axis_packetizer:1.0.1 axis_packetizer_0
set_property -dict {CONFIG.CNTR_WIDTH 16} [get_bd_cells axis_packetizer_0]
create_bd_cell -type ip -vlnv pavel-demin:user:axis_packetizer:1.0.1 axis_packetizer_1
set_property -dict {CONFIG.CNTR_WIDTH 16} [get_bd_cells axis_packetizer_1]
create_bd_cell -type ip -vlnv pavel-demin:user:axi_cfg_register:1.1 axi_cfg_register_rx_freq
create_bd_cell -type ip -vlnv xilinx.com:ip:axis_broadcaster:1.1 axis_broadcaster_3
set_property -dict [list \
  CONFIG.M_TDATA_NUM_BYTES 4 \
  CONFIG.S_TDATA_NUM_BYTES 4 \
  CONFIG.HAS_TLAST 1 \
  CONFIG.M00_TDATA_REMAP {tdata[31:0]} \
  CONFIG.M01_TDATA_REMAP {tdata[31:0]} \
] [get_bd_cells axis_broadcaster_3]
create_bd_cell -type ip -vlnv xilinx.com:ip:axis_combiner:1.1 axis_combiner_1
set_property -dict {CONFIG.TDATA_NUM_BYTES 8 CONFIG.NUM_SI 8 CONFIG.HAS_TLAST 1} [get_bd_cells axis_combiner_1]
create_bd_cell -type ip -vlnv xilinx.com:ip:axis_data_fifo:1.1 axis_data_fifo_0
set_property -dict {CONFIG.TDATA_NUM_BYTES 4 CONFIG.FIFO_MODE 2} [get_bd_cells axis_data_fifo_0]
create_bd_cell -type ip -vlnv xilinx.com:ip:axis_data_fifo:1.1 axis_data_fifo_1
set_property -dict {CONFIG.TDATA_NUM_BYTES 4 CONFIG.FIFO_MODE 2} [get_bd_cells axis_data_fifo_1]
create_bd_cell -type ip -vlnv xilinx.com:ip:axis_dwidth_converter:1.1 axis_dwidth_converter_0
set_property -dict {CONFIG.M_TDATA_NUM_BYTES 4 CONFIG.HAS_TLAST 1 CONFIG.HAS_MI_TKEEP 0} [get_bd_cells axis_dwidth_converter_0]
create_bd_cell -type ip -vlnv xilinx.com:ip:axis_switch:1.1 axis_switch
set_property -dict [list \
  CONFIG.NUM_SI 2 \
  CONFIG.TDATA_NUM_BYTES 4 \
  CONFIG.HAS_TLAST 1 \
  CONFIG.ARB_ON_MAX_XFERS 1024 \
  CONFIG.ARB_ON_TLAST 1 \
  CONFIG.ARB_ALGORITHM 3 \
  CONFIG.M00_AXIS_HIGHTDEST 0x0000000f \
] [get_bd_cells axis_switch]
create_bd_cell -type ip -vlnv xilinx.com:ip:cic_compiler:4.0 cic_compiler_0
set_property -dict [list \
  CONFIG.Filter_Type Decimation \
  CONFIG.Number_Of_Stages 5 \
  CONFIG.Number_Of_Channels 16 \
  CONFIG.Sample_Rate_Changes Fixed \
  CONFIG.Fixed_Or_Initial_Rate 120 \
  CONFIG.Minimum_Rate 120 \
  CONFIG.Maximum_Rate 120 \
  CONFIG.Input_Sample_Frequency 3.90625 \
  CONFIG.Clock_Frequency 125.0000000 \
  CONFIG.SamplePeriod 1 \
  CONFIG.Input_Data_Width 32 \
  CONFIG.Quantization Truncation \
  CONFIG.Output_Data_Width 32 \
  CONFIG.Use_Xtreme_DSP_Slice true \
  CONFIG.Use_Streaming_Interface false \
  CONFIG.HAS_ARESETN true \
  CONFIG.HAS_DOUT_TREADY true \
] [get_bd_cells cic_compiler_0]
create_bd_cell -type ip -vlnv xilinx.com:ip:cic_compiler:4.0 cic_compiler_1
set_property -dict [list \
  CONFIG.Filter_Type Decimation \
  CONFIG.Number_Of_Stages 5 \
  CONFIG.Number_Of_Channels 16 \
  CONFIG.Sample_Rate_Changes Fixed \
  CONFIG.Fixed_Or_Initial_Rate 10 \
  CONFIG.Minimum_Rate 10 \
  CONFIG.Maximum_Rate 10 \
  CONFIG.Input_Sample_Frequency 3.90625 \
  CONFIG.Clock_Frequency 125.0000000 \
  CONFIG.SamplePeriod 1 \
  CONFIG.Input_Data_Width 32 \
  CONFIG.Quantization Truncation \
  CONFIG.Output_Data_Width 32 \
  CONFIG.Use_Xtreme_DSP_Slice true \
  CONFIG.Use_Streaming_Interface false \
  CONFIG.HAS_ARESETN true \
  CONFIG.HAS_DOUT_TREADY true \
] [get_bd_cells cic_compiler_1]
create_bd_cell -type ip -vlnv xilinx.com:ip:fir_compiler:7.2 fir_compiler_0
set_property -dict [list \
  CONFIG.CoefficientVector {-1.64776395523261e-08, -4.73223982493382e-08, -7.93114097748734e-10, 3.09341607494277e-08, 1.86268604565617e-08, 3.27485571200346e-08, -6.29908653657968e-09, -1.52279861575043e-07, -8.30460847858456e-08, 3.14535491822606e-07, 3.05626738325402e-07, -4.74172694219994e-07, -7.13495049416347e-07, 5.47323968241002e-07, 1.33462183148789e-06, -4.14140755019506e-07, -2.15051006195781e-06, -6.77410015715413e-08, 3.07546485446303e-06, 1.03702255417565e-06, -3.94436393706816e-06, -2.59191311589838e-06, 4.51537519422448e-06, 4.74782575774399e-06, -4.49284245797096e-06, -7.39824596121288e-06, 3.57216304293944e-06, 1.0289531398643e-05, -1.50382000963687e-06, -1.30208669437029e-05, -1.8320780740752e-06, 1.50781578706169e-05, 6.35464869916574e-06, -1.5905693254477e-05, -1.17324822432291e-05, 1.50110146034995e-05, 1.73719815499574e-05, -1.20943524633858e-05, -2.24668827259553e-05, 7.16974344173206e-06, 2.61032685003911e-05, -6.63576078703743e-07, -2.74292794572945e-05, -6.55062322922545e-06, 2.5864354889803e-05, 1.32043152416442e-05, -2.13170377303369e-05, -1.7790015052466e-05, 1.4366401658372e-05, 1.88196488042346e-05, -6.35769575620025e-06, -1.51624671610732e-05, -6.3454751890034e-07, 6.41574547942767e-06, 4.00779001049893e-06, 6.75760336386084e-06, -1.00538045567379e-06, -2.24030234065108e-05, -1.07626302618669e-05, 3.72333834565482e-05, 3.27008161208513e-05, -4.68605170112616e-05, -6.46526581514427e-05, 4.62599879903061e-05, 0.000104401861517261, -3.05403948192664e-05, -0.00014745720335074, -4.12013707266912e-06, 0.000187185910308468, 5.9472285269084e-05, -0.000215374917579779, -0.000134302073078784, 0.000223224152976694, 0.00022383529853513, -0.000202700646279518, -0.000319623716269056, 0.000148096208070561, 0.00041005036860653, -5.75597854424301e-05, -0.000481514995957391, -6.56763133492148e-05, 0.000520250999114949, 0.000212664164338231, -0.000514618719419215, -0.000369005842837135, 0.000457467389871147, 0.000515973656086604, -0.000348477939755869, -0.000632881279945779, 0.000195649794954827, 0.000700188749146281, -1.57992717633881e-05, -0.000703205392036612, -0.000166376697710665, 0.000635843920605569, 0.00032083226194399, -0.000503811084211153, -0.000416255319934634, 0.000326569991673316, 0.000425391875921946, -0.00013746695448704, -0.000331045335837557, -1.84322419198225e-05, 0.000131952870425038, 8.8991373620273e-05, 0.000152406451111629, -2.20059552576483e-05, -0.000479109327658611, -0.000226158943701414, 0.000781596108897923, 0.000680336287236396, -0.000973841573779158, -0.00133743086810108, 0.000957505429554979, 0.00215823795933061, -0.000633058497914659, -0.00306239583565753, -8.62773868301778e-05, 0.00392749237767837, 0.00125890086582158, -0.0045932013828814, -0.002899064621986, 0.00487080892138405, 0.00496271652177841, -0.00455788126865406, -0.00733667233358662, 0.00345716360480598, 0.00983253607996904, -0.00139819324342049, -0.0121861637129463, -0.00174034328863689, 0.014062282608939, 0.00600853672502155, -0.0150655751552465, -0.01137014160612, 0.0147483575782911, 0.0176872274320504, -0.0126185258485222, -0.0247131655485743, 0.00813090350262748, 0.0320864711007864, -0.000645151353472906, -0.0393170493516836, -0.0106924075067383, 0.0457366439777749, 0.0272501703222767, -0.0503214712404459, -0.0517158392679872, 0.0510195785361982, 0.0905708960358907, -0.0416085827802432, -0.163747940036716, -0.0107991247506511, 0.356391980570419, 0.554821620626239, 0.356391980570419, -0.0107991247506511, -0.163747940036716, -0.0416085827802432, 0.0905708960358907, 0.0510195785361982, -0.0517158392679871, -0.0503214712404459, 0.0272501703222767, 0.0457366439777748, -0.0106924075067384, -0.0393170493516836, -0.000645151353472902, 0.0320864711007864, 0.00813090350262744, -0.0247131655485743, -0.0126185258485222, 0.0176872274320504, 0.014748357578291, -0.01137014160612, -0.0150655751552464, 0.00600853672502154, 0.014062282608939, -0.00174034328863689, -0.0121861637129463, -0.0013981932434205, 0.00983253607996903, 0.00345716360480599, -0.00733667233358662, -0.00455788126865407, 0.00496271652177837, 0.00487080892138405, -0.00289906462198599, -0.0045932013828814, 0.00125890086582158, 0.00392749237767837, -8.62773868301858e-05, -0.00306239583565753, -0.000633058497914665, 0.00215823795933062, 0.000957505429554986, -0.00133743086810109, -0.00097384157377915, 0.000680336287236399, 0.000781596108897926, -0.000226158943701417, -0.000479109327658599, -2.20059552576474e-05, 0.000152406451111619, 8.89913736202697e-05, 0.000131952870425043, -1.84322419198184e-05, -0.000331045335837562, -0.000137466954487046, 0.000425391875921945, 0.000326569991673318, -0.000416255319934626, -0.000503811084211157, 0.000320832261943976, 0.000635843920605571, -0.000166376697710658, -0.000703205392036611, -1.57992717634175e-05, 0.000700188749146282, 0.000195649794954849, -0.00063288127994578, -0.000348477939755879, 0.000515973656086602, 0.000457467389871152, -0.000369005842837133, -0.00051461871941922, 0.00021266416433823, 0.00052025099911495, -6.5676313349214e-05, -0.000481514995957386, -5.75597854424309e-05, 0.00041005036860653, 0.000148096208070561, -0.000319623716269053, -0.000202700646279518, 0.00022383529853513, 0.000223224152976694, -0.000134302073078785, -0.000215374917579779, 5.94722852690836e-05, 0.000187185910308467, -4.1201370726696e-06, -0.000147457203350739, -3.05403948192655e-05, 0.00010440186151726, 4.62599879903048e-05, -6.46526581514424e-05, -4.68605170112612e-05, 3.27008161208512e-05, 3.72333834565472e-05, -1.07626302618669e-05, -2.24030234065122e-05, -1.00538045567376e-06, 6.75760336386114e-06, 4.00779001049914e-06, 6.41574547942654e-06, -6.34547518900236e-07, -1.51624671610739e-05, -6.35769575620011e-06, 1.88196488042347e-05, 1.43664016583718e-05, -1.77900150524658e-05, -2.13170377303367e-05, 1.32043152416438e-05, 2.58643548898028e-05, -6.55062322922483e-06, -2.74292794572945e-05, -6.63576078704085e-07, 2.61032685003909e-05, 7.16974344173231e-06, -2.24668827259554e-05, -1.20943524633859e-05, 1.73719815499574e-05, 1.50110146034996e-05, -1.1732482243229e-05, -1.59056932544774e-05, 6.35464869916573e-06, 1.5078157870617e-05, -1.83207807407521e-06, -1.30208669437035e-05, -1.50382000963686e-06, 1.02895313986436e-05, 3.57216304293944e-06, -7.39824596121333e-06, -4.49284245797099e-06, 4.74782575774417e-06, 4.51537519422448e-06, -2.59191311589829e-06, -3.94436393706815e-06, 1.03702255417562e-06, 3.07546485446302e-06, -6.77410015715271e-08, -2.15051006195779e-06, -4.14140755019505e-07, 1.33462183148789e-06, 5.47323968241007e-07, -7.13495049416342e-07, -4.7417269421995e-07, 3.05626738325399e-07, 3.1453549182257e-07, -8.30460847858442e-08, -1.52279861575044e-07, -6.29908653657931e-09, 3.27485571200189e-08, 1.86268604565597e-08, 3.09341607494308e-08, -7.93114097748315e-10, -4.73223982493358e-08, -1.64776395523266e-08} \
  CONFIG.Coefficient_Sets 1 \
  CONFIG.Coefficient_Reload false \
  CONFIG.Filter_Type Decimation \
  CONFIG.Interpolation_Rate 1 \
  CONFIG.Decimation_Rate 2 \
  CONFIG.Zero_Pack_Factor 1 \
  CONFIG.Number_Channels 16 \
  CONFIG.Select_Pattern All \
  CONFIG.Number_Paths 1 \
  CONFIG.RateSpecification Frequency_Specification \
  CONFIG.SamplePeriod 1 \
  CONFIG.Sample_Frequency 0.03255208333333333 \
  CONFIG.Clock_Frequency 125 \
  CONFIG.Coefficient_Sign Signed \
  CONFIG.Quantization Maximize_Dynamic_Range \
  CONFIG.Coefficient_Width 24 \
  CONFIG.BestPrecision true \
  CONFIG.Coefficient_Fractional_Bits 23 \
  CONFIG.Coefficient_Structure Inferred \
  CONFIG.Data_Width 32 \
  CONFIG.Output_Rounding_Mode Convergent_Rounding_to_Even \
  CONFIG.Output_Width 32 \
  CONFIG.Filter_Architecture Systolic_Multiply_Accumulate \
  CONFIG.Optimization_Goal Speed \
  CONFIG.Optimization_Selection All \
  CONFIG.Optimization_List Data_Path_Fanout,Pre-Adder_Pipeline,Coefficient_Fanout,Control_Path_Fanout,Control_Column_Fanout,Control_Broadcast_Fanout,Control_LUT_Pipeline,No_BRAM_Read_First_Mode,Optimal_Column_Lengths,Other \
  CONFIG.ColumnConfig 1 \
  CONFIG.DATA_Has_TLAST Not_Required \
  CONFIG.M_DATA_Has_TREADY true \
  CONFIG.S_DATA_Has_TUSER Not_Required \
  CONFIG.M_DATA_Has_TUSER Not_Required \
  CONFIG.Has_ARESETn true \
] [get_bd_cells fir_compiler_0]
create_bd_cell -type ip -vlnv xilinx.com:ip:fir_compiler:7.2 fir_compiler_1
set_property -dict [list \
  CONFIG.CoefficientVector {-1.64776395523261e-08, -4.73223982493382e-08, -7.93114097748734e-10, 3.09341607494277e-08, 1.86268604565617e-08, 3.27485571200346e-08, -6.29908653657968e-09, -1.52279861575043e-07, -8.30460847858456e-08, 3.14535491822606e-07, 3.05626738325402e-07, -4.74172694219994e-07, -7.13495049416347e-07, 5.47323968241002e-07, 1.33462183148789e-06, -4.14140755019506e-07, -2.15051006195781e-06, -6.77410015715413e-08, 3.07546485446303e-06, 1.03702255417565e-06, -3.94436393706816e-06, -2.59191311589838e-06, 4.51537519422448e-06, 4.74782575774399e-06, -4.49284245797096e-06, -7.39824596121288e-06, 3.57216304293944e-06, 1.0289531398643e-05, -1.50382000963687e-06, -1.30208669437029e-05, -1.8320780740752e-06, 1.50781578706169e-05, 6.35464869916574e-06, -1.5905693254477e-05, -1.17324822432291e-05, 1.50110146034995e-05, 1.73719815499574e-05, -1.20943524633858e-05, -2.24668827259553e-05, 7.16974344173206e-06, 2.61032685003911e-05, -6.63576078703743e-07, -2.74292794572945e-05, -6.55062322922545e-06, 2.5864354889803e-05, 1.32043152416442e-05, -2.13170377303369e-05, -1.7790015052466e-05, 1.4366401658372e-05, 1.88196488042346e-05, -6.35769575620025e-06, -1.51624671610732e-05, -6.3454751890034e-07, 6.41574547942767e-06, 4.00779001049893e-06, 6.75760336386084e-06, -1.00538045567379e-06, -2.24030234065108e-05, -1.07626302618669e-05, 3.72333834565482e-05, 3.27008161208513e-05, -4.68605170112616e-05, -6.46526581514427e-05, 4.62599879903061e-05, 0.000104401861517261, -3.05403948192664e-05, -0.00014745720335074, -4.12013707266912e-06, 0.000187185910308468, 5.9472285269084e-05, -0.000215374917579779, -0.000134302073078784, 0.000223224152976694, 0.00022383529853513, -0.000202700646279518, -0.000319623716269056, 0.000148096208070561, 0.00041005036860653, -5.75597854424301e-05, -0.000481514995957391, -6.56763133492148e-05, 0.000520250999114949, 0.000212664164338231, -0.000514618719419215, -0.000369005842837135, 0.000457467389871147, 0.000515973656086604, -0.000348477939755869, -0.000632881279945779, 0.000195649794954827, 0.000700188749146281, -1.57992717633881e-05, -0.000703205392036612, -0.000166376697710665, 0.000635843920605569, 0.00032083226194399, -0.000503811084211153, -0.000416255319934634, 0.000326569991673316, 0.000425391875921946, -0.00013746695448704, -0.000331045335837557, -1.84322419198225e-05, 0.000131952870425038, 8.8991373620273e-05, 0.000152406451111629, -2.20059552576483e-05, -0.000479109327658611, -0.000226158943701414, 0.000781596108897923, 0.000680336287236396, -0.000973841573779158, -0.00133743086810108, 0.000957505429554979, 0.00215823795933061, -0.000633058497914659, -0.00306239583565753, -8.62773868301778e-05, 0.00392749237767837, 0.00125890086582158, -0.0045932013828814, -0.002899064621986, 0.00487080892138405, 0.00496271652177841, -0.00455788126865406, -0.00733667233358662, 0.00345716360480598, 0.00983253607996904, -0.00139819324342049, -0.0121861637129463, -0.00174034328863689, 0.014062282608939, 0.00600853672502155, -0.0150655751552465, -0.01137014160612, 0.0147483575782911, 0.0176872274320504, -0.0126185258485222, -0.0247131655485743, 0.00813090350262748, 0.0320864711007864, -0.000645151353472906, -0.0393170493516836, -0.0106924075067383, 0.0457366439777749, 0.0272501703222767, -0.0503214712404459, -0.0517158392679872, 0.0510195785361982, 0.0905708960358907, -0.0416085827802432, -0.163747940036716, -0.0107991247506511, 0.356391980570419, 0.554821620626239, 0.356391980570419, -0.0107991247506511, -0.163747940036716, -0.0416085827802432, 0.0905708960358907, 0.0510195785361982, -0.0517158392679871, -0.0503214712404459, 0.0272501703222767, 0.0457366439777748, -0.0106924075067384, -0.0393170493516836, -0.000645151353472902, 0.0320864711007864, 0.00813090350262744, -0.0247131655485743, -0.0126185258485222, 0.0176872274320504, 0.014748357578291, -0.01137014160612, -0.0150655751552464, 0.00600853672502154, 0.014062282608939, -0.00174034328863689, -0.0121861637129463, -0.0013981932434205, 0.00983253607996903, 0.00345716360480599, -0.00733667233358662, -0.00455788126865407, 0.00496271652177837, 0.00487080892138405, -0.00289906462198599, -0.0045932013828814, 0.00125890086582158, 0.00392749237767837, -8.62773868301858e-05, -0.00306239583565753, -0.000633058497914665, 0.00215823795933062, 0.000957505429554986, -0.00133743086810109, -0.00097384157377915, 0.000680336287236399, 0.000781596108897926, -0.000226158943701417, -0.000479109327658599, -2.20059552576474e-05, 0.000152406451111619, 8.89913736202697e-05, 0.000131952870425043, -1.84322419198184e-05, -0.000331045335837562, -0.000137466954487046, 0.000425391875921945, 0.000326569991673318, -0.000416255319934626, -0.000503811084211157, 0.000320832261943976, 0.000635843920605571, -0.000166376697710658, -0.000703205392036611, -1.57992717634175e-05, 0.000700188749146282, 0.000195649794954849, -0.00063288127994578, -0.000348477939755879, 0.000515973656086602, 0.000457467389871152, -0.000369005842837133, -0.00051461871941922, 0.00021266416433823, 0.00052025099911495, -6.5676313349214e-05, -0.000481514995957386, -5.75597854424309e-05, 0.00041005036860653, 0.000148096208070561, -0.000319623716269053, -0.000202700646279518, 0.00022383529853513, 0.000223224152976694, -0.000134302073078785, -0.000215374917579779, 5.94722852690836e-05, 0.000187185910308467, -4.1201370726696e-06, -0.000147457203350739, -3.05403948192655e-05, 0.00010440186151726, 4.62599879903048e-05, -6.46526581514424e-05, -4.68605170112612e-05, 3.27008161208512e-05, 3.72333834565472e-05, -1.07626302618669e-05, -2.24030234065122e-05, -1.00538045567376e-06, 6.75760336386114e-06, 4.00779001049914e-06, 6.41574547942654e-06, -6.34547518900236e-07, -1.51624671610739e-05, -6.35769575620011e-06, 1.88196488042347e-05, 1.43664016583718e-05, -1.77900150524658e-05, -2.13170377303367e-05, 1.32043152416438e-05, 2.58643548898028e-05, -6.55062322922483e-06, -2.74292794572945e-05, -6.63576078704085e-07, 2.61032685003909e-05, 7.16974344173231e-06, -2.24668827259554e-05, -1.20943524633859e-05, 1.73719815499574e-05, 1.50110146034996e-05, -1.1732482243229e-05, -1.59056932544774e-05, 6.35464869916573e-06, 1.5078157870617e-05, -1.83207807407521e-06, -1.30208669437035e-05, -1.50382000963686e-06, 1.02895313986436e-05, 3.57216304293944e-06, -7.39824596121333e-06, -4.49284245797099e-06, 4.74782575774417e-06, 4.51537519422448e-06, -2.59191311589829e-06, -3.94436393706815e-06, 1.03702255417562e-06, 3.07546485446302e-06, -6.77410015715271e-08, -2.15051006195779e-06, -4.14140755019505e-07, 1.33462183148789e-06, 5.47323968241007e-07, -7.13495049416342e-07, -4.7417269421995e-07, 3.05626738325399e-07, 3.1453549182257e-07, -8.30460847858442e-08, -1.52279861575044e-07, -6.29908653657931e-09, 3.27485571200189e-08, 1.86268604565597e-08, 3.09341607494308e-08, -7.93114097748315e-10, -4.73223982493358e-08, -1.64776395523266e-08} \
  CONFIG.Coefficient_Sets 1 \
  CONFIG.Coefficient_Reload false \
  CONFIG.Filter_Type Decimation \
  CONFIG.Interpolation_Rate 1 \
  CONFIG.Decimation_Rate 2 \
  CONFIG.Zero_Pack_Factor 1 \
  CONFIG.Number_Channels 16 \
  CONFIG.Select_Pattern All \
  CONFIG.Number_Paths 1 \
  CONFIG.RateSpecification Frequency_Specification \
  CONFIG.SamplePeriod 1 \
  CONFIG.Sample_Frequency 0.390625 \
  CONFIG.Clock_Frequency 125 \
  CONFIG.Coefficient_Sign Signed \
  CONFIG.Quantization Maximize_Dynamic_Range \
  CONFIG.Coefficient_Width 24 \
  CONFIG.BestPrecision true \
  CONFIG.Coefficient_Fractional_Bits 23 \
  CONFIG.Coefficient_Structure Inferred \
  CONFIG.Data_Width 32 \
  CONFIG.Output_Rounding_Mode Convergent_Rounding_to_Even \
  CONFIG.Output_Width 32 \
  CONFIG.Filter_Architecture Systolic_Multiply_Accumulate \
  CONFIG.Optimization_Goal Area \
  CONFIG.Optimization_Selection None \
  CONFIG.Optimization_List None \
  CONFIG.ColumnConfig 4 \
  CONFIG.DATA_Has_TLAST Not_Required \
  CONFIG.M_DATA_Has_TREADY true \
  CONFIG.S_DATA_Has_TUSER Not_Required \
  CONFIG.M_DATA_Has_TUSER Not_Required \
  CONFIG.Has_ARESETn true \
] [get_bd_cells fir_compiler_1]
create_bd_cell -type ip -vlnv xilinx.com:ip:xlconcat:2.1 xlconcat_0
set_property -dict [list \
  CONFIG.NUM_PORTS 4 \
  CONFIG.IN0_WIDTH 24 \
  CONFIG.IN1_WIDTH 8 \
  CONFIG.IN2_WIDTH 24 \
  CONFIG.IN3_WIDTH 8 \
] [get_bd_cells xlconcat_0]
create_bd_cell -type ip -vlnv xilinx.com:ip:xlconstant:1.1 xlconstant_0
set_property -dict {CONFIG.CONST_WIDTH 2 CONFIG.CONST_VAL 0} [get_bd_cells xlconstant_0]
create_bd_cell -type ip -vlnv xilinx.com:ip:xlconstant:1.1 xlconstant_1
set_property -dict {CONFIG.CONST_WIDTH 8} [get_bd_cells xlconstant_1]
create_bd_cell -type ip -vlnv xilinx.com:ip:xlconstant:1.1 xlconstant_2
set_property -dict {CONFIG.CONST_WIDTH 8 CONFIG.CONST_VAL 2} [get_bd_cells xlconstant_2]
create_bd_cell -type ip -vlnv xilinx.com:ip:xlconstant:1.1 xlconstant_3
set_property -dict {CONFIG.CONST_WIDTH 16 CONFIG.CONST_VAL 511} [get_bd_cells xlconstant_3]
create_bd_cell -type ip -vlnv xilinx.com:ip:xlconstant:1.1 xlconstant_4
set_property -dict {CONFIG.CONST_WIDTH 16 CONFIG.CONST_VAL 1023} [get_bd_cells xlconstant_4]
create_bd_cell -type ip -vlnv xilinx.com:ip:xlslice:1.0 xlslice_0
set_property -dict {CONFIG.DOUT_WIDTH 24 CONFIG.DIN_TO 3 CONFIG.DIN_FROM 26} [get_bd_cells xlslice_0]
create_bd_cell -type ip -vlnv xilinx.com:ip:xlslice:1.0 xlslice_1
set_property -dict {CONFIG.DOUT_WIDTH 24 CONFIG.DIN_TO 3 CONFIG.DIN_FROM 26} [get_bd_cells xlslice_1]
create_bd_cell -type ip -vlnv xilinx.com:ip:xlslice:1.0 xlslice_rx_0
set_property -dict {CONFIG.DOUT_WIDTH 32 CONFIG.DIN_TO 0 CONFIG.DIN_FROM 31 CONFIG.DIN_WIDTH 1024} [get_bd_cells xlslice_rx_0]
create_bd_cell -type ip -vlnv xilinx.com:ip:xlslice:1.0 xlslice_rx_1
set_property -dict {CONFIG.DIN_TO 32 CONFIG.DIN_FROM 63 CONFIG.DIN_WIDTH 1024} [get_bd_cells xlslice_rx_1]
create_bd_cell -type ip -vlnv xilinx.com:ip:xlslice:1.0 xlslice_rx_2
set_property -dict {CONFIG.DOUT_WIDTH 32 CONFIG.DIN_TO 64 CONFIG.DIN_FROM 95 CONFIG.DIN_WIDTH 1024} [get_bd_cells xlslice_rx_2]
create_bd_cell -type ip -vlnv xilinx.com:ip:xlslice:1.0 xlslice_rx_3
set_property -dict {CONFIG.DOUT_WIDTH 32 CONFIG.DIN_TO 96 CONFIG.DIN_FROM 127 CONFIG.DIN_WIDTH 1024} [get_bd_cells xlslice_rx_3]
create_bd_cell -type hier rx_2
create_bd_cell -type hier rx_3
create_bd_cell -type hier rx_0
create_bd_cell -type hier rx_4
create_bd_cell -type hier rx_5
create_bd_cell -type hier rx_6
create_bd_cell -type hier rx_7
create_bd_cell -type ip -vlnv xilinx.com:ip:xlslice:1.0 xlslice_rx_4
set_property -dict {CONFIG.DOUT_WIDTH 32 CONFIG.DIN_TO 128 CONFIG.DIN_FROM 159 CONFIG.DIN_WIDTH 1024} [get_bd_cells xlslice_rx_4]
create_bd_cell -type ip -vlnv xilinx.com:ip:xlslice:1.0 xlslice_rx_5
set_property -dict {CONFIG.DOUT_WIDTH 32 CONFIG.DIN_TO 160 CONFIG.DIN_FROM 191 CONFIG.DIN_WIDTH 1024} [get_bd_cells xlslice_rx_5]
create_bd_cell -type ip -vlnv xilinx.com:ip:xlslice:1.0 xlslice_rx_6
set_property -dict {CONFIG.DOUT_WIDTH 32 CONFIG.DIN_TO 192 CONFIG.DIN_FROM 223 CONFIG.DIN_WIDTH 1024} [get_bd_cells xlslice_rx_6]
create_bd_cell -type ip -vlnv xilinx.com:ip:xlslice:1.0 xlslice_rx_7
set_property -dict {CONFIG.DOUT_WIDTH 32 CONFIG.DIN_TO 224 CONFIG.DIN_FROM 255 CONFIG.DIN_WIDTH 1024} [get_bd_cells xlslice_rx_7]
